# Altium schematic sheet qspi_flash.schdoc
size 209 x 297 mm; Scale: 1:1; DocumentType: Ñõåìà ýëåêòðè÷åñêàÿ ïðèíöèïèàëüíàÿ; FirstReferrence: ÀÁÂÃ.123456.001; Title1str: {Наименование}; PageSetup: Record=PageOptions¦CenterHorizontal=False¦CenterVertical=False¦PrintScale=0.95¦XCorrection=0.00¦YCorrection=0.00¦PrintKind=1¦BorderSize=5000000¦LeftOffset=0¦BottomOffset=0¦Orientation=1¦PaperLength=1000¦PaperWidth=1000¦Scale=100¦PaperSource=15¦PrintQuality=600¦MediaType=1¦DitherType=10¦PaperKind=A4¦PrintScaleMode=1; DocumentType1str: {Документ}; DocumentType2str: {Документ}
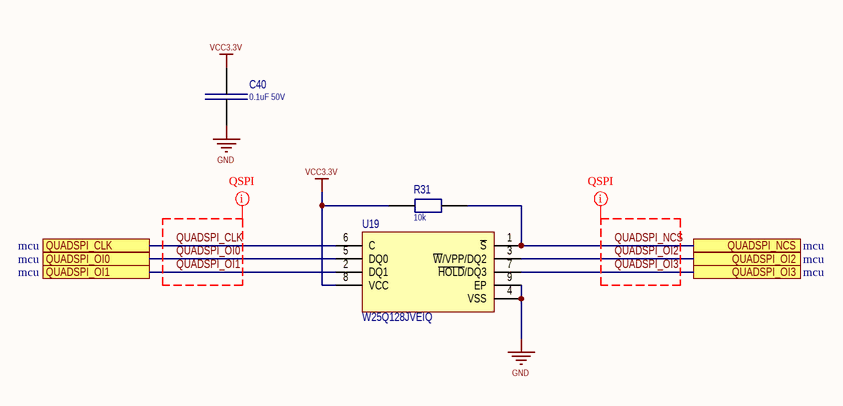
[diagram p0: qspi_flash.schdoc]

## Parts
C40  0.1uF 50V  [C_0603]
R31  10k  [R_0603]
U19  W25Q128JVEIQ  [W-PDFN-8 (MLP8) – 8mm ? 6mm  Se]

## Ports
QUADSPI_CLK (see mcu), QUADSPI_NCS (see mcu), QUADSPI_OI0 (see mcu), QUADSPI_OI1 (see mcu), QUADSPI_OI2 (see mcu), QUADSPI_OI3 (see mcu)

## Nets
GND: C40.1 U19.4(VSS) U19.9(EP)
VCC3.3V: C40.2 R31.1 U19.8(VCC)
QUADSPI_CLK: U19.6(C) ; port QUADSPI_CLK
QUADSPI_NCS: R31.2 U19.1(~{S}) ; port QUADSPI_NCS
QUADSPI_OI0: U19.5(DQ0) ; port QUADSPI_OI0
QUADSPI_OI1: U19.2(DQ1) ; port QUADSPI_OI1
QUADSPI_OI2: U19.3(~{W}/VPP/DQ2) ; port QUADSPI_OI2
QUADSPI_OI3: U19.7(~{HOLD}/DQ3) ; port QUADSPI_OI3

## Layout directives
net class QSPI: QUADSPI_CLK, QUADSPI_NCS, QUADSPI_OI0, QUADSPI_OI1, QUADSPI_OI2, QUADSPI_OI3

## Library data of the parts
C40 = C0603: Capacitor; Part: CC0603KPX7R9BB104; Value: 0.1uF 50V
R31 = RES_SMD: Resistor; Part: RC0603FR-0710KL; Alternative Part: *; Value: 10k
U19 = MT25QL********W9-0SIT: Flash Memory; Part: W25Q128JVEIQ; Alternative Part: *